# EAGLE design Dolgin_ATTinyV3 (EAGLE 9.3.2)
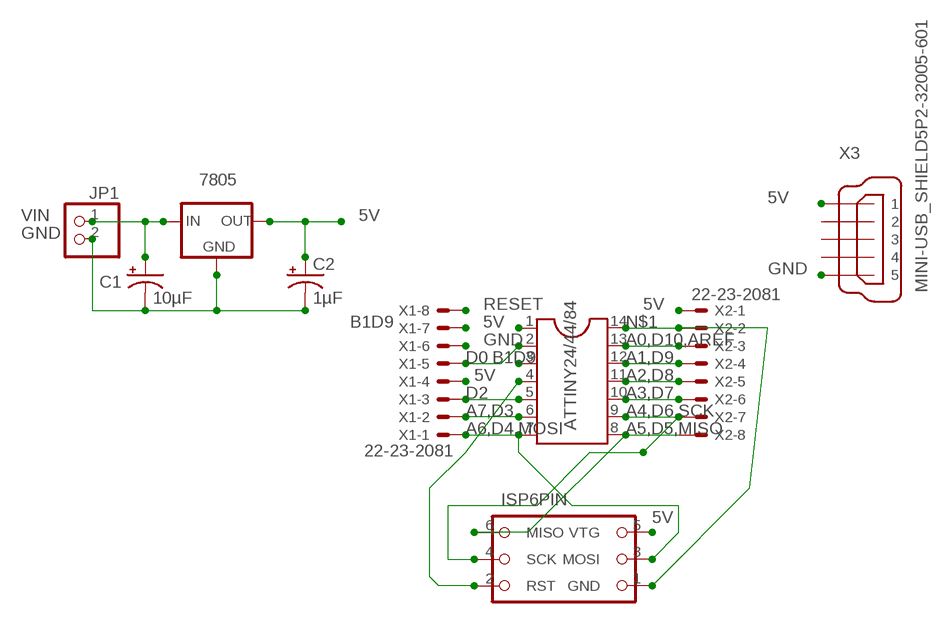
[diagram p0: schematic, sheet 1]

## Parts
7805  LM78XX  [78XXL]
ATTINY24/44/84  DIL14  [DIL14]
C1  10µF  CAPACITOR_POLARIZED  [CPOL-RADIAL-2.5MM-5MM]
C2  1µF  CAPACITOR_POLARIZED  [CPOL-RADIAL-2.5MM-5MM]
H1  ISP_HEADER  [ICSP]
JP1  PINHD-1X2  [1X02]
X1  22-23-2081  [22-23-2081]
X2  22-23-2081  [22-23-2081]
X3  MINI-USB_SHIELD5P2-32005-601  [32005-601]

## Nets
5V: 7805.OUT ATTINY24/44/84.1 C2.1(+) H1.5(VTG) X1.4 X2.1 X3.1
A0,D10,AREF: ATTINY24/44/84.13 X2.3
A1,D9: ATTINY24/44/84.12 X2.4
A2,D8: ATTINY24/44/84.11 X2.5
A3,D7: ATTINY24/44/84.10 X2.6
A4,D6,SCK: ATTINY24/44/84.9 H1.4(SCK) X2.7
A5,D5,MISO: ATTINY24/44/84.8 H1.6(MISO) X2.8
A6,D4,MOSI: ATTINY24/44/84.7 H1.3(MOSI) X1.1
A7,D3: ATTINY24/44/84.6 X1.2
B1D9: ATTINY24/44/84.3 X1.7
D0: ATTINY24/44/84.2 X1.5
D2: ATTINY24/44/84.5 X1.3
GND: 7805.GND C1.2(-) C2.2(-) JP1.2 X1.6 X3.5
N$1: ATTINY24/44/84.14 H1.1(GND) X2.2
RESET: ATTINY24/44/84.4 H1.2(RST) X1.8
VIN: 7805.IN C1.1(+) JP1.1
Unconnected: X3.2 X3.3 X3.4 X3.M1(S1) X3.M2(S2)

## Library data of the parts
7805 = ACES_THT:LM78XX: 1+ A Positive Voltage Regulators 5V Example: LM7805 <https://media.digikey.com/pdf/Data%20Sheets/ON%20Semiconductor%20PDFs/MC7800(A,AE),NCV7800.pdf>
ATTINY24/44/84 = ic-package:DIL14: Dual In Line / Socket
C1 C2 = ACES_THT:CAPACITOR_POLARIZED
H1 = ACES_THT:ISP_HEADER: No more excuses for getting these lines crossed!
JP1 = pinhead:PINHD-1X2: PIN HEADER
X1 X2 = con-molex:22-23-2081: .100" (2.54mm) Center Header - 8 Pin; MF: MOLEX; MPN: 22-23-2081; OC_FARNELL: 1756826; OC_NEWARK: 01C7592
X3 = con-cypressindustries:MINI-USB_SHIELD5P2-: MINI USB-B R/A DIP 5pol. Source: www.cypressindustries.com; OC_FARNELL: unknown; OC_NEWARK: unknown

## Board
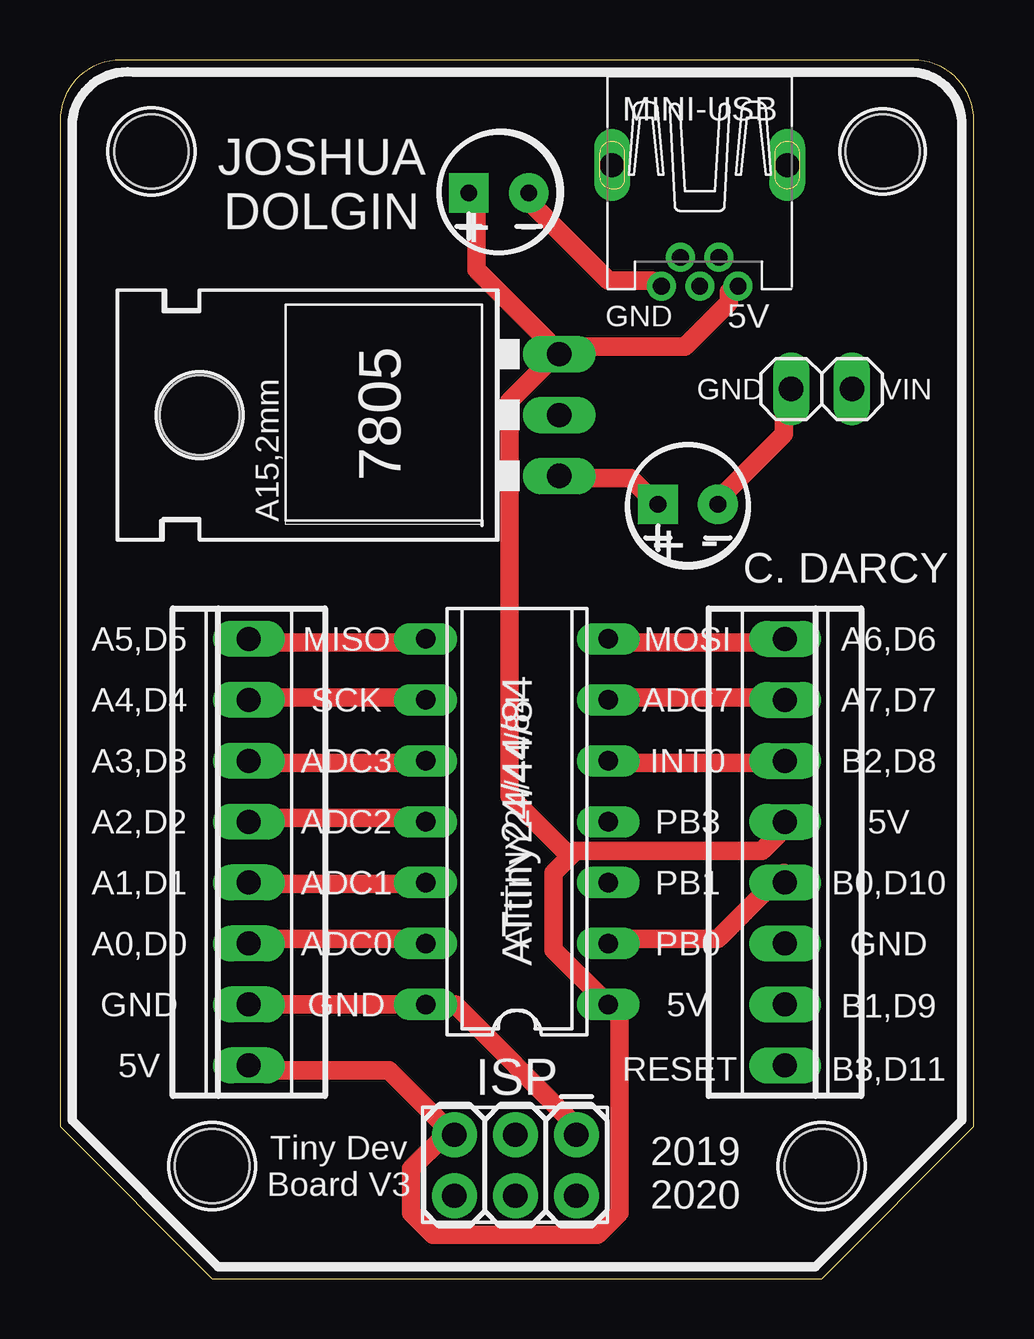
[diagram p1: board, top side]
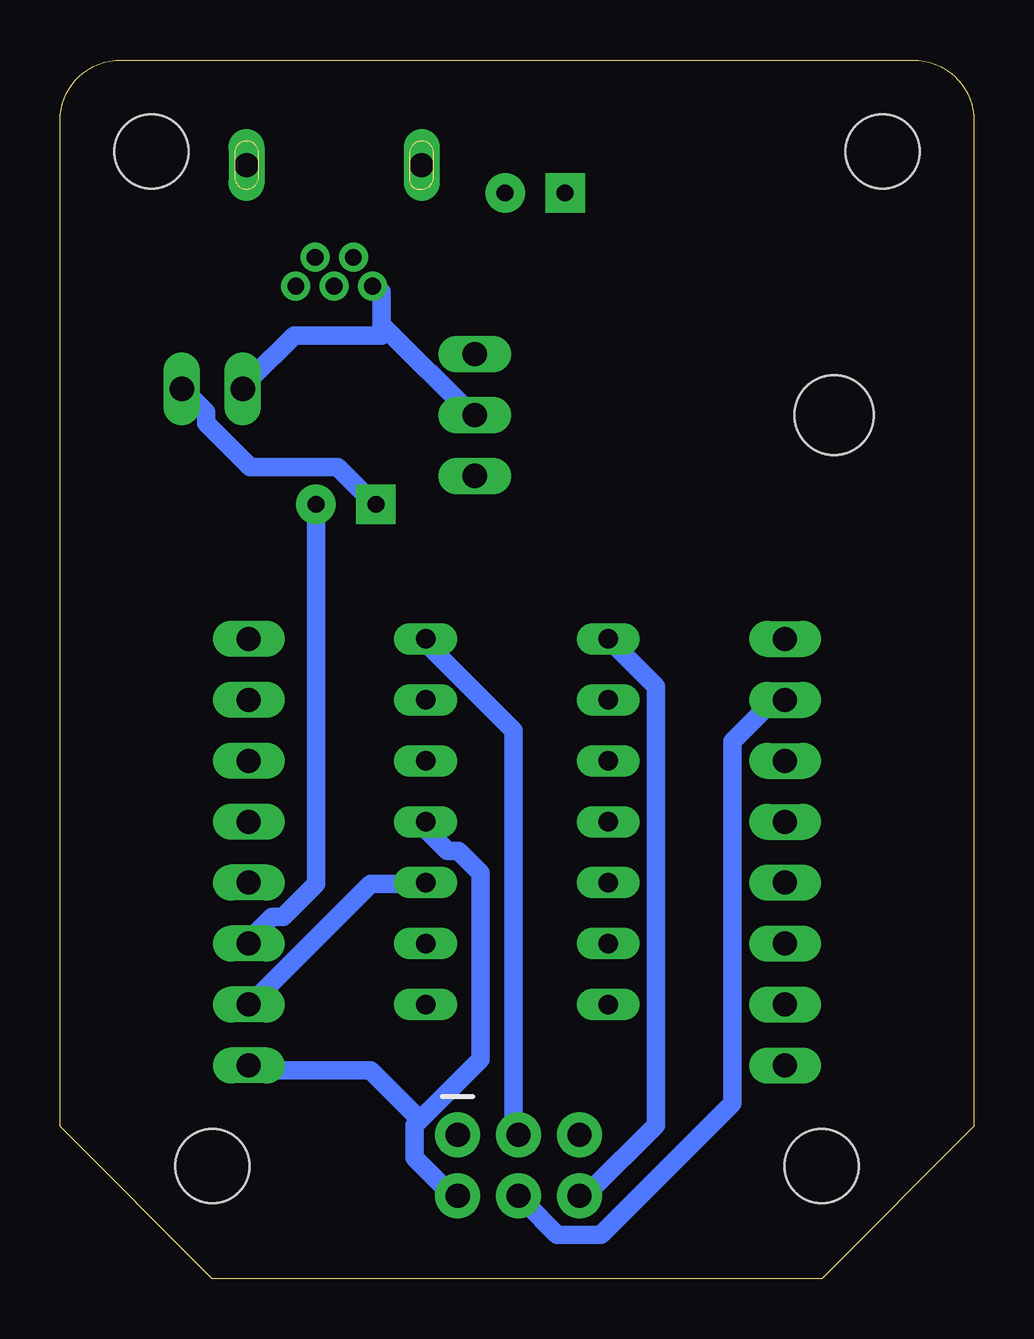
[diagram p2: board, bottom side, seen from below]

Size 38.1 x 50.8 mm. Coordinates in mm from the lower left corner, seen from the top.
Outline: 38.1,6.35 38.1,48.26 arc90 35.56,50.8 2.54,50.8 arc90 0,48.26 0,6.35 6.35,0 31.75,0 38.1,6.35
Copper layers (1*16): Top 0.035mm / dielectric 1.5mm / Bottom 0.035mm
Design rules "default *": minimum track width 30mil, minimum drill 0.35mm, track to track 6mil, track to pad 6mil, pad to pad 6mil, via to via 6mil, smd to smd 6mil, copper to edge 40mil, drill to drill 6mil, minimum pad ring 10mil, minimum via ring 8mil, stop-mask expansion 4mil, vias tented up to drill 0mil, thermal gap 10mil
Holes 3.1 mm at 3.81,46.99 34.29,46.99 31.75,4.7 6.35,4.7

### Footprints (pad centres in the part's own frame; a part is rotated, then mirrored left to right if it is on the bottom)
78XXL = drill 1.016 long: GND 0,-3.81; IN -2.54,-3.81; OUT 2.54,-3.81 | hole 3.302: 0,11.176
DIL14 = drill 0.813 long: 1 -7.62,-3.81; 2 -5.08,-3.81; 3 -2.54,-3.81; 4 0,-3.81; 5 2.54,-3.81; 6 5.08,-3.81; 7 7.62,-3.81; 8 7.62,3.81; 9 5.08,3.81; 10 2.54,3.81; 11 0,3.81; 12 -2.54,3.81; 13 -5.08,3.81; 14 -7.62,3.81
CPOL-RADIAL-2.5MM-5MM = drill 0.7 pad 1.651 square: 1 1.25,0 | drill 0.7 pad 1.651: 2 -1.25,0
ICSP = drill 1.016 pad 1.88: 1 0,0; 2 0,2.54; 3 2.54,0; 4 2.54,2.54; 5 5.08,0; 6 5.08,2.54
1X02 = drill 1.016 long: 1 -1.27,0; 2 1.27,0
22-23-2081 = drill 1 long: 1 -8.89,0; 2 -6.35,0; 3 -3.81,0; 4 -1.27,0; 5 1.27,0; 6 3.81,0; 7 6.35,0; 8 8.89,0
32005-601 = drill 0.7 pad 1.016: 1 2.825,1.6; 2 1.625,0.8; 3 2.825,0; 4 1.625,-0.8; 5 2.825,-1.6 | drill 1 pad 1.422 long: M1 -2.225,3.65; M2 -2.225,-3.65

### Placement (x,y rotation side)
7805  17,36 90 top
ATTINY24/44/84  19.05,19.05 90 top
C1  26.18,32.28 180 top
C2  18.29,45.26 180 top
H1  21.52,6 180 top
JP1  31.75,37.08 180 top
U$1  [ACES_LOGO_SMALL]  34.04,42.16 0 top
X1  30.23,17.78 270 top
X2  7.87,17.78 90 top
X3  26.67,44.2 270 top

### Tracks (layer width: path | path; a pad name or v marks a point on that pad's centre or on a via)
5V
  Top 0.762: X3.1 27.89,41.15 27.89,40.69 26.06,38.86 21.03,38.86 7805.OUT | C2.1 17.37,44.81 17.37,42.06 20.57,38.86 7805.OUT | X2.1 8.23,8.69 13.72,8.69 16,6.4 H1.5 16,5.94 14.63,4.57 14.63,2.74 15.54,1.83 22.4,1.83 23.32,2.74 23.32,10.97 ATTINY24/44/84.1 20.57,13.72 20.57,16.92 21.26,17.6 | 21.26,17.6 21.49,17.83 29.26,17.83 30.18,18.75 X1.4 | 21.26,17.6 18.75,20.12 18.75,36.58 20.57,38.41 7805.OUT
A0,D10,AREF
  Top 0.762: ATTINY24/44/84.13 15.09,14.17 8.23,14.17 X2.3
A1,D9
  Top 0.762: ATTINY24/44/84.12 15.09,16.46 8.23,16.46 X2.4
A2,D8
  Top 0.762: ATTINY24/44/84.11 15.09,19.2 8.23,19.2 X2.5
A3,D7
  Top 0.762: ATTINY24/44/84.10 15.09,21.49 8.23,21.49 X2.6
A4,D6,SCK
  Top 0.762: ATTINY24/44/84.9 15.09,24.23 8.23,24.23 X2.7
  Bottom 0.762: H1.4 18.75,3.2 17.37,1.83 15.54,1.83 10.06,7.32 10.06,22.4 8.23,24.23 X2.7
A5,D5,MISO
  Top 0.762: ATTINY24/44/84.8 15.09,26.52 8.23,26.52 X2.8
  Bottom 0.762: ATTINY24/44/84.8 13.26,24.69 13.26,6.4 16,3.66 H1.6
A6,D4,MOSI
  Top 0.762: ATTINY24/44/84.7 22.86,26.52 30.18,26.52 X1.1
  Bottom 0.762: H1.3 19.2,6.4 19.2,22.86 22.86,26.52 ATTINY24/44/84.7
A7,D3
  Top 0.762: ATTINY24/44/84.6 22.86,24.23 30.18,24.23 X1.2
B1D9
  Bottom 0.762: ATTINY24/44/84.3 22.86,16.46 25.15,16.46 30.18,11.43 X1.7
D0
  Top 0.762: ATTINY24/44/84.2 22.86,14.17 27.43,14.17 30.18,16.92 X1.5
D2
  Top 0.762: ATTINY24/44/84.5 22.86,21.49 30.18,21.49 X1.3
GND
  Top 0.762: X3.5 24.69,41.6 22.86,41.6 19.66,44.81 C2.2 | JP1.2 30.18,37.03 30.18,35.2 27.43,32.46 C1.2
  Bottom 0.762: 24.46,39.55 24.69,39.78 24.69,41.15 X3.5 | 24.46,39.55 21.03,36.12 7805.GND | X1.6 30.18,14.17 29.26,15.09 28.8,15.09 27.43,16.46 27.43,32 C1.2 | 24.46,39.55 24.69,39.32 28.35,39.32 30.18,37.49 JP1.2
N$1
  Top 0.762: X2.2 ATTINY24/44/84.14 16.46,11.43 21.49,6.4 H1.1
RESET
  Bottom 0.762: 23.09,6.63 23.32,6.4 23.32,5.03 21.95,3.66 H1.2 | 23.09,6.63 20.57,9.14 20.57,16.92 21.49,17.83 21.95,17.83 22.86,18.75 ATTINY24/44/84.4 | 23.09,6.63 25.15,8.69 30.18,8.69 X1.8
VIN
  Top 0.762: 7805.IN 21.03,33.38 23.77,33.38 24.69,32.46 C1.1
  Bottom 0.762: JP1.1 32.92,37.03 32,36.12 32,35.66 30.18,33.83 26.52,33.83 25.15,32.46 C1.1

### Text on the board
_tsilk: MINI-USB | JOSHUA / DOLGIN | + | - | GND | 5V | GND | VIN | + | - | C. DARCY | A5,D5 | MISO | MOSI | A6,D6 | A4,D4 | SCK | ADC7 | A7,D7 | A3,D3 | ADC3 | INT0 | B2,D8 | A2,D2 | ADC2 | ATtiny24/44/84 | PB3 | 5V | A1,D1 | ADC1 | PB1 | B0,D10 | A0,D0 | ADC0 | PB0 | GND | GND | GND | 5V | B1,D9 | 5V | RESET | B3,D11 | ISP | Tiny Dev / Board V3 | 2019 / 2020